# Altium project PCB_Project.PrjPcb
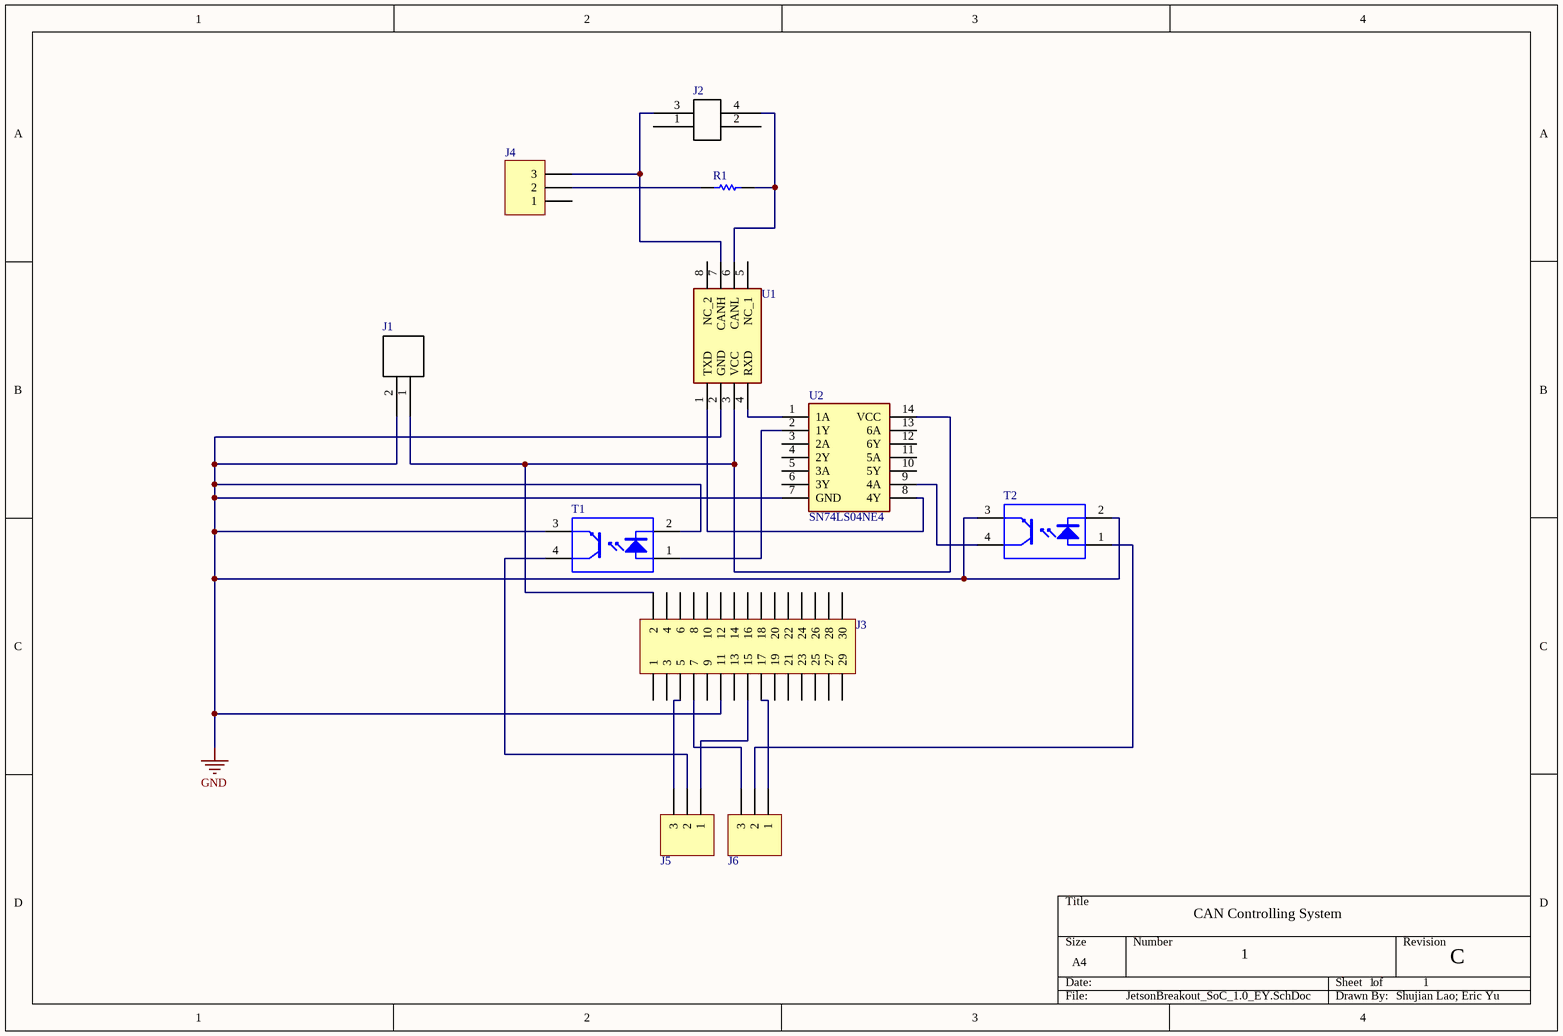
[diagram p0: JetsonBreakout_SoC_1.0_EY.SchDoc]
1 sheet, 11 parts. Net scope: global (net labels, ports and power ports of the same name join across sheets).
Board file: JetsonBreakout_SoC_1.0_EY.PcbDoc

## Sheet JetsonBreakout_SoC_1.0_EY.SchDoc
size A4

### Parts
J1  (no value)  [1510482204]
J2  (no value)  [0430450427]
J3  (no value)  [HDR2X15]
J4  (no value)  [HDR1X3]
J5  (no value)  [HDR1X3]
J6  (no value)  [HDR1X3]
R1  (no value)  [RESC0805(2012)_N]
T1  (no value)  [FAIR-MDIP-4_V]
T2  (no value)  [FAIR-MDIP-4_V]
U1  (no value)  [SOIC127P600X175-8N]
U2  SN74LS04NE4  [DIP794W53P254L1930H508Q14N]

### Nets
GND: J1.2 J3.11 T1.2(CATHODE) T1.3(EMITTER) T2.2(CATHODE) T2.3(EMITTER) U1.2(GND) U2.7(GND)
NetJ1_1: J1.1 J3.2 U1.3(VCC) U2.14(VCC)
NetJ2_3: J2.3 J4.3 U1.7(CANH)
NetJ2_4: J2.4 R1.2 U1.6(CANL)
NetJ3_5: J3.5 J5.3
NetJ3_7: J3.7 J6.3
NetJ3_15: J3.15 J5.1
NetJ3_17: J3.17 J6.1
NetJ4_2: J4.2 R1.1
NetJ5_2: J5.2 T1.4(COLLECTOR)
NetJ6_2: J6.2 T2.1(ANODE)
NetT1_1: T1.1(ANODE) U2.2(1Y)
NetT2_4: T2.4(COLLECTOR) U2.9(4A)
NetU1_1: U1.1(TXD) U2.8(4Y)
NetU1_4: U1.4(RXD) U2.1(1A)

Not connected (* = marked no-connect by the designer): J2 1 2; J3 1 3 4 6 8 9 10 12 13 14 16 18 19 20 21 22 23 24 25 26 27 28 29 30; J4 1; U1 5(NC_1) 8(NC_2); U2 3(2A) 4(2Y) 5(3A) 6(3Y) 10(5Y) 11(5A) 12(6Y) 13(6A)

### Notes on the sheet
- CAN Controlling System
- 1
- C
- Shujian Lao; Eric Yu

### Library data of the parts
J1 = Molex 6.5MM  power connector
J2 = Molex micro-fit 4-pin (dual row schematic): Molex micro-fit 3.0, P/N 0430450427
J3 = Header 15X2: Header, 15-Pin, Dual row; LatestRevisionDate: 17-Jul-2002; LatestRevisionNote: Re-released for DXP Platform.; Publisher: Altium Limited
J4-J6 = Header 3: Header, 3-Pin; LatestRevisionDate: 17-Jul-2002; LatestRevisionNote: Re-released for DXP Platform.; Publisher: Altium Limited
R1 = 120R 5% 0805: 120R 0.125W 5% 0805 (2012 Metric)  SMD; Case-Metric: 2012; Value: 120.00 Ohm; Case-EIA: 0805; Tolerance: 5 %; Technology: SMT; Power: 0.125 W
T1 T2 = CMP-2000-06281-1: Phototransistor Optocoupler, 4 us Rise, 3 us Fall, 5000 Vrms, -55 to 110 degC, 4-Pin MDIP, RoHS, Tape and Reel; Manufacturer: Fairchild Semiconductor; Current Transfer Ratio (Min): 300%@5mA; Rise / Fall Time (Typ): 4µs,3µs; Vce Saturation (Max): 200mV; Current Transfer Ratio (Max): 600%@5mA; Package Version: 10/2014; Current - DC Forward (If) (Max): 50mA; Online Catalog: FOD617,814,817Series; Voltage - Output (Max): 70V; Number of Channels: 1; Input Type: DC; Voltage - Forward (Vf) (Typ): 1.2V; Other Names: FOD817DSDDKR; Output Type: Transistor; Packaging: Digi-Reel®; Category: Isolators; Package / Case: 4-SMD,GullWing; Voltage - Isolation: 5000Vrms; Mounting Technology: SurfaceMount; Series: -; Mounting Type: SurfaceMount; Supplier Device Package: 4-SMD; Family: Optoisolators-Transistor,PhotovoltaicOutput; Standard Package: 1; Package Description: 4-Pin Surface Mount Device, Body 6.5 x 4.6 mm, Pitch 2.54 mm; Datasheet Version: Rev. 2.8, 11/2015; Package Reference: MDIP 4L; Manufacturer URL: https://www.fairchildsemi.com/; Current - Output / Channel: 50mA; Turn On / Turn Off Time (Typ): -; Operating Temperature: -55°C~110°C; Datasheet URL: https://www.fairchildsemi.com/datasheets/FO/FOD817D.pdf; Package URL: https://www.fairchildsemi.com/package-drawings/N0/N04C.pdf
U1 = TCAN332DR: Integrated Circuit; Manufacturer_Name: Texas Instruments; Datasheet Link: http://www.ti.com/lit/ds/symlink/tcan332.pdf; Height: 1.75mm; Manufacturer_Part_Number: TCAN332DR; Mouser Part Number: 595-TCAN332DR; Mouser Price/Stock: https://www.mouser.com/Search/Refine.aspx?Keyword=595-TCAN332DR
U2 = SN74LS04NE4: Integrated Circuit; Manufacturer_Name: Texas Instruments; Datasheet Link: http://www.ti.com/lit/ds/symlink/sn74ls04.pdf; Height: 5.08mm; Manufacturer_Part_Number: SN74LS04NE4; Mouser Part Number: 595-SN74LS04NE4; Mouser Price/Stock: https://www.mouser.com/Search/Refine.aspx?Keyword=595-SN74LS04NE4